# EAGLE schematic FlasherHighpower (EAGLE 9.5.2)
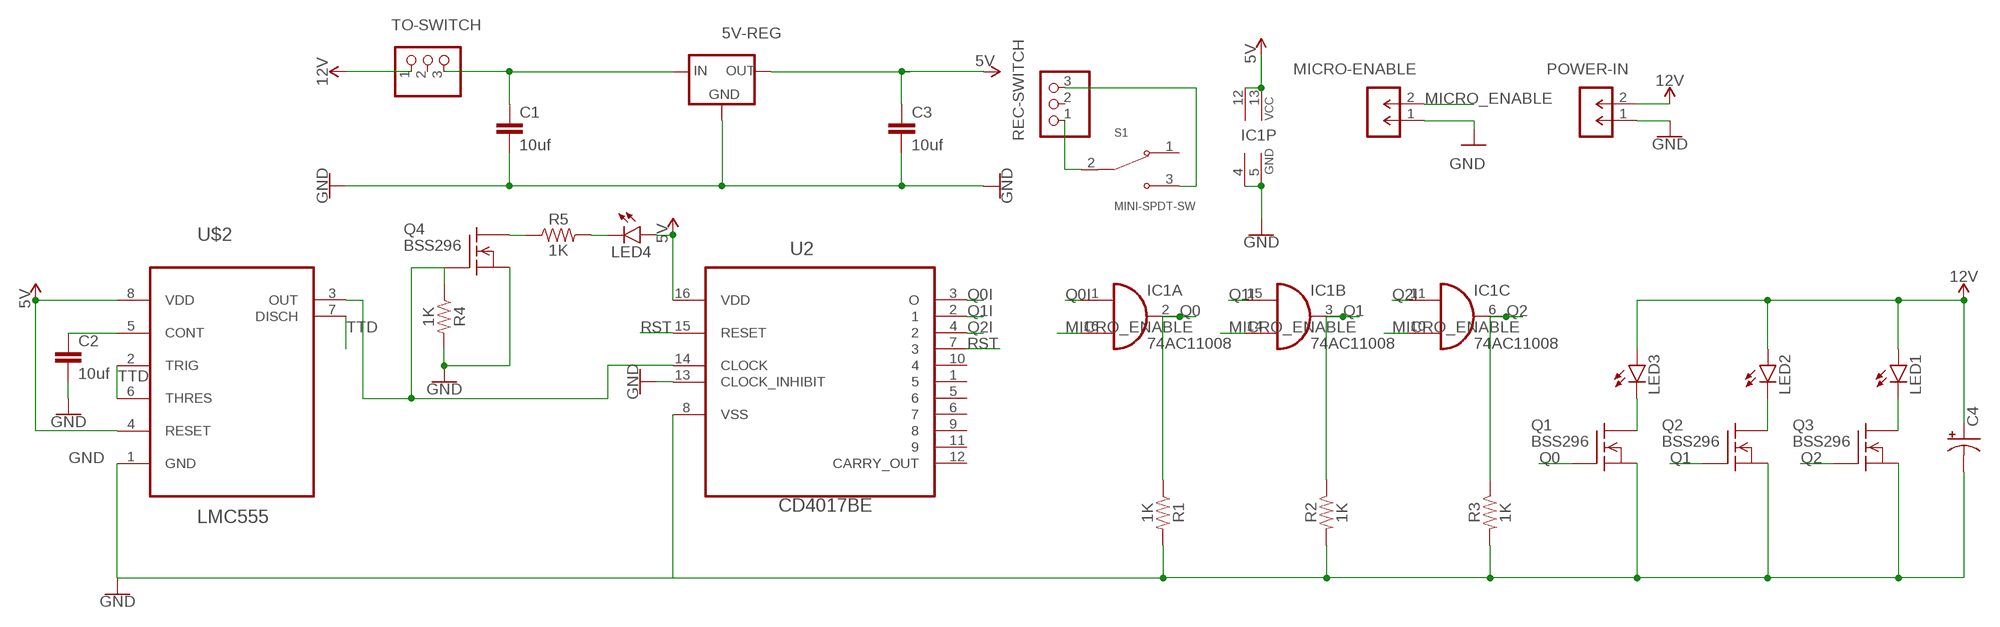
[diagram p0: schematic, sheet 1]

## Parts
5V-REG  LD1117V33  [LD1117V33]
C1  10uf  C2,5-3  [C2.5-3]
C2  10uf  C2,5-3  [C2.5-3]
C3  10uf  C2,5-3  [C2.5-3]
C4  CPOL-USE3.5-8  [E3,5-8]
IC1  74AC11008  [DIL16]
LED1  LED5MM  [LED5MM]
LED2  LED5MM  [LED5MM]
LED3  LED5MM  [LED5MM]
LED4  LED5MM  [LED5MM]
MICRO-ENABLE  M-1X02-SIP-100-40Y  [SIP-100-02-40Y]
POWER-IN  M-1X02-SIP-100-40Y  [SIP-100-02-40Y]
Q1  BSS296  [TO92]
Q2  BSS296  [TO92]
Q3  BSS296  [TO92]
Q4  BSS296  [TO92]
R1  1K  10MOHM-HORIZ-1/4W-5%  [AXIAL-0.3]
R2  1K  10MOHM-HORIZ-1/4W-5%  [AXIAL-0.3]
R3  1K  10MOHM-HORIZ-1/4W-5%  [AXIAL-0.3]
R4  1K  10MOHM-HORIZ-1/4W-5%  [AXIAL-0.3]
R5  1K  10MOHM-HORIZ-1/4W-5%  [AXIAL-0.3]
REC-SWITCH  PINHD-1X3CB  [1X03-CLEANBIG]
S1  MINI-SPDT-SW  [SW_MINI-SPDT-SW]
TO-SWITCH  PINHD-1X3CB  [1X03-CLEANBIG]
U2  CD4017BE  [DIP254P762X508-16]
U$2  LMC555  [8-DIP]

## Nets
5V: 5V-REG.OUT C3.1 IC1.12(P:VCC) IC1.13(P:VCC) LED4.A U2.16(VDD) U$2.4(RESET) U$2.8(VDD)
12V: C4.+ LED1.A LED2.A LED3.A POWER-IN.2 TO-SWITCH.1
+5V: 5V-REG.IN C1.1 TO-SWITCH.3
GND: 5V-REG.GND C1.2 C2.2 C3.2 C4.- IC1.4(P:GND) IC1.5(P:GND) MICRO-ENABLE.1 POWER-IN.1 Q1.3(S) Q2.3(S) Q3.3(S) Q4.3(S) R1.P$2 R2.P$2 R3.P$2 R4.P$2 U2.8(VSS) U2.13(CLOCK_INHIBIT) U$2.1(GND)
MICRO_ENABLE: IC1.10(C:I1) IC1.14(B:I1) IC1.16(A:I1) MICRO-ENABLE.2
N$1: LED1.K(C) Q3.2(D)
N$2: LED2.K(C) Q2.2(D)
N$3: Q4.1(G) R4.P$1 U2.14(CLOCK) U$2.3(OUT)
N$4: LED3.K(C) Q1.2(D)
N$5: REC-SWITCH.3 S1.3
N$6: REC-SWITCH.1 S1.2
N$7: C2.1 U$2.5(CONT)
N$8: Q4.2(D) R5.P$1
N$9: LED4.K(C) R5.P$2
Q0: IC1.2(A:O) Q1.1(G) R1.P$1
Q0I: IC1.1(A:I0) U2.3(O)
Q1: IC1.3(B:O) Q2.1(G) R2.P$1
Q1I: IC1.15(B:I0) U2.2
Q2: IC1.6(C:O) Q3.1(G) R3.P$1
Q2I: IC1.11(C:I0) U2.4
RST: U2.7 U2.15(RESET)
TTD: U$2.2(TRIG) U$2.6(THRES) U$2.7(DISCH)
Unconnected: IC1.7(D:O) IC1.8(D:I1) IC1.9(D:I0) REC-SWITCH.2 S1.1 TO-SWITCH.2 U2.1 U2.5 U2.6 U2.9 U2.10 U2.11 U2.12(CARRY_OUT)

## Library data of the parts
5V-REG = LD1117V33:LD1117V33
C1-C3 = capacitor-wima:C: CAPACITOR naming: grid - package width
C4 = rcl:CPOL-US: POLARIZED CAPACITOR, American symbol; SPICEPREFIX: C
IC1 = 74ac-logic:74AC11008: Quadruple 2-input AND
LED1-LED4 = led:LED: LED OSRAM: - CHIPLED LG R971, LG N971, LY N971, LG Q971, LY Q971, LO R971, LY R971 LH N974, LH R974 LS Q976, LO Q976, LY Q976 LO Q996 - Hyper CHIPLED LW Q18S LB Q993, LB Q99A, LB R99A - SideLED LS A670, LO A670, LY A670, LG A670, LP A670 LB A673, LV A673, LT A673, LW A673 LH A674 LY A675 LS A676, LA A676, LO A676, LY A676, LW A676 LS A679, LY A679, LG A679 - Hyper Micro SIDELED® LS Y876, LA Y876, LO Y876, LY Y876 LT Y87S - SmartLED LW L88C, LW L88S LB L89C, LB L89S, LG L890 LS L89K, LO L89K, LY L89K LS L896, LA L896, LO L896, LY L896 - TOPLED LS T670, LO T670, LY T670, LG T670, LP T670 LSG T670, LSP T670, LSY T670, LOP T670, LYG T670 LG T671, LOG T671, LSG T671 LB T673, LV T673, LT T673, LW T673 LH T674 LS T676, LA T676, LO T676, LY T676, LB T676, LH T676, LSB T676, LW T676 LB T67C, LV T67C, LT T67C, LS T67K, LO T67K, LY T67K, LW E67C LS E67B, LA E67B, LO E67B, LY E67B, LB E67C, LV E67C, LT E67C LW T67C LS T679, LY T679, LG T679 LS T770, LO T770, LY T770, LG T770, LP T770 LB T773, LV T773, LT T773, LW T773 LH T774 LS E675, LA E675, LY E675, LS T675 LS T776, LA T776, LO T776, LY T776, LB T776 LHGB T686 LT T68C, LB T68C - Hyper Mini TOPLED® LB M676 - Mini TOPLED Santana® LG M470 LS M47K, LO M47K, LY M47K Source: http://www.osram.convergy.de LUXEON: - LUMILED® LXK2-PW12-R00, LXK2-PW12-S00, LXK2-PW14-U00, LXK2-PW14-V00 LXK2-PM12-R00, LXK2-PM12-S00, LXK2-PM14-U00 LXK2-PE12-Q00, LXK2-PE12-R00, LXK2-PE12-S00, LXK2-PE14-T00, LXK2-PE14-U00 LXK2-PB12-K00, LXK2-PB12-L00, LXK2-PB12-M00, LXK2-PB14-N00, LXK2-PB14-P00, LXK2-PB14-Q00 LXK2-PR12-L00, LXK2-PR12-M00, LXK2-PR14-Q00, LXK2-PR14-R00 LXK2-PD12-Q00, LXK2-PD12-R00, LXK2-PD12-S00 LXK2-PH12-R00, LXK2-PH12-S00 LXK2-PL12-P00, LXK2-PL12-Q00, LXK2-PL12-R00 Source: www.luxeon.com KINGBRIGHT: KA-3528ASYC Source: www.kingbright.com; SPICEPREFIX: L
MICRO-ENABLE POWER-IN = con-headers-jp:M-1X02-: MALE HEADER
Q1-Q4 = transistor-fet:BSS296: N-Channel Enhancement MOSFET not checked
R1-R5 = SparkFun-Resistors:10MOHM: RES-09327; PROD_ID: RES-09327; VALUE: 10M
REC-SWITCH TO-SWITCH = adafruit:PINHD-1X3: PIN HEADER
S1 = MINI-SPDT-SW:MINI-SPDT-SW: Simple breadboard friendly SPDT slide switch. Rated at 30V/200mA with operating force of 250 +/-100gf.; AVAILABILITY: Unavailable; DESCRIPTION: Slide Switches MINI SPDT SWITCH; MF: Gravitech; MP: MINI-SPDT-SW; PACKAGE: None; PRICE: None
U2 = CD4017BE:CD4017BE: CMOS COUNTER/DIVIDERS; AVAILABILITY: Unavailable; DESCRIPTION: Counter IC Counter, Decade 1 Element 10 Bit Positive Edge 16-PDIP; MF: Texas; MP: CD4017BE; PACKAGE: DIP-16 Intersil; PRICE: None
U$2 = LMC555:LMC555: 555Timer; AVAILABILITY: Unavailable; DESCRIPTION: 555 Type, Timer/Oscillator _Single_ IC 3MHz 8-SOIC; MF: Texas Instruments; MP: LMC-555; PACKAGE: SOIC-8 Texas Instruments; PRICE: None